# EAGLE design M-Controller (EAGLE 7.6.0)
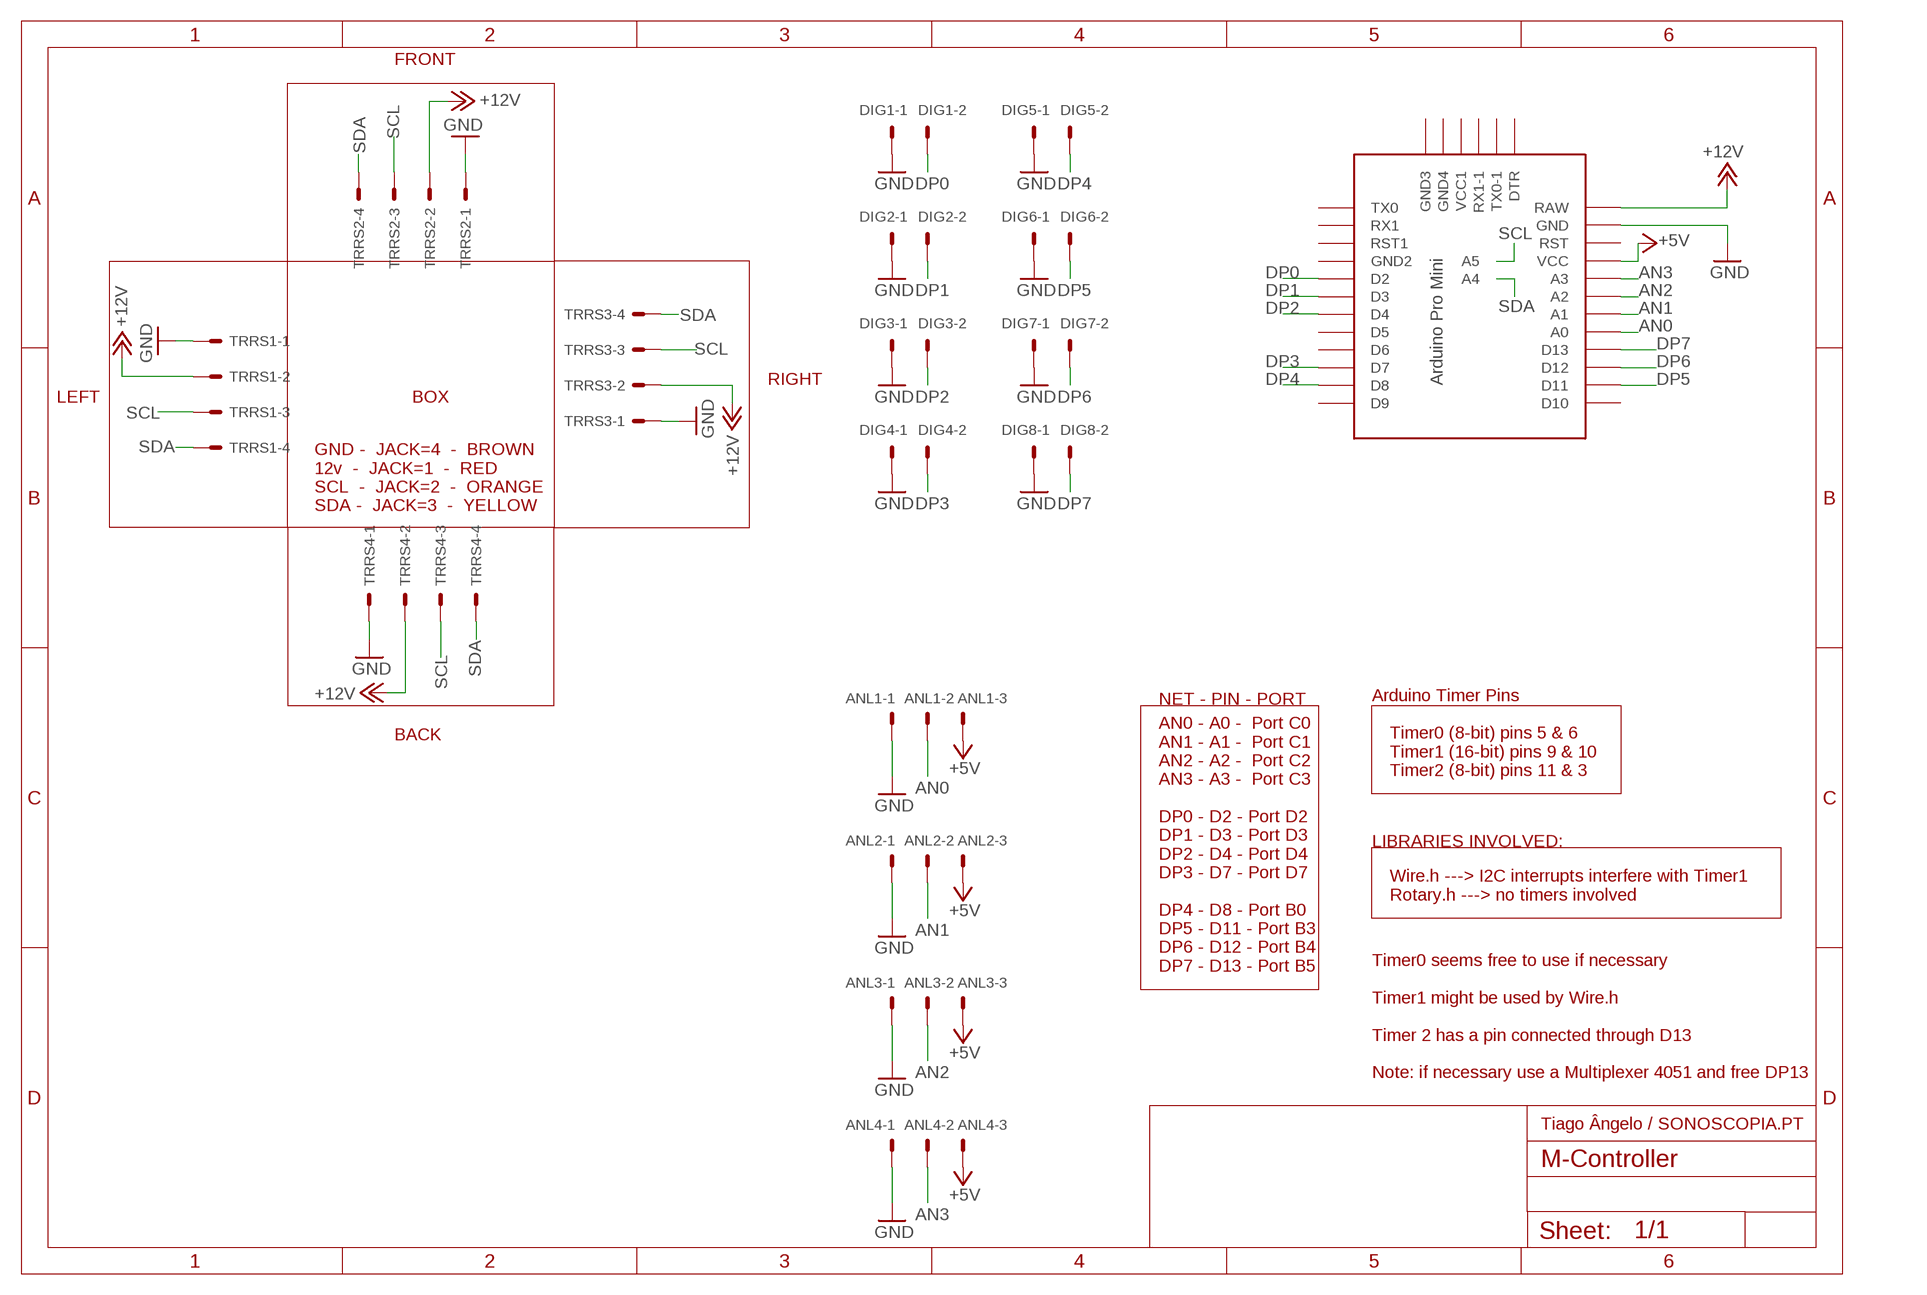
[diagram p0: schematic, sheet 1]

## Parts
ANL1  22-27-2031-03  [6410-03]
ANL2  22-27-2031-03  [6410-03]
ANL3  22-27-2031-03  [6410-03]
ANL4  22-27-2031-03  [6410-03]
DIG1  22-27-2021-02  [6410-02]
DIG2  22-27-2021-02  [6410-02]
DIG3  22-27-2021-02  [6410-02]
DIG4  22-27-2021-02  [6410-02]
DIG5  22-27-2021-02  [6410-02]
DIG6  22-27-2021-02  [6410-02]
DIG7  22-27-2021-02  [6410-02]
DIG8  22-27-2021-02  [6410-02]
TRRS1  22-27-2041-04  [6410-04]
TRRS2  22-27-2041-04  [6410-04]
TRRS3  22-27-2041-04  [6410-04]
TRRS4  22-27-2041-04  [6410-04]
U$1  PRO-MINI-2  [PRO-MINI-2]

## Nets
+5V: ANL1.3 ANL2.3 ANL3.3 ANL4.3 U$1.VCC
+12V: TRRS1.2 TRRS2.2 TRRS3.2 TRRS4.2 U$1.RAW
AN0: ANL1.2 U$1.A0
AN1: ANL2.2 U$1.A1
AN2: ANL3.2 U$1.A2
AN3: ANL4.2 U$1.A3
DP0: DIG1.2 U$1.D2
DP1: DIG2.2 U$1.D3
DP2: DIG3.2 U$1.D4
DP3: DIG4.2 U$1.D7
DP4: DIG5.2 U$1.D8
DP5: DIG6.2 U$1.D11
DP6: DIG7.2 U$1.D12
DP7: DIG8.2 U$1.D13
GND: ANL1.1 ANL2.1 ANL3.1 ANL4.1 DIG1.1 DIG2.1 DIG3.1 DIG4.1 DIG5.1 DIG6.1 DIG7.1 DIG8.1 TRRS1.1 TRRS2.1 TRRS3.1 TRRS4.1 U$1.GND
SCL: TRRS1.3 TRRS2.3 TRRS3.3 TRRS4.3 U$1.A5
SDA: TRRS1.4 TRRS2.4 TRRS3.4 TRRS4.4 U$1.A4
Unconnected: U$1.D5 U$1.D6 U$1.D9 U$1.D10 U$1.DTR U$1.GND1(GND2) U$1.GND2(GND3) U$1.GND3(GND4) U$1.RST U$1.RST1 U$1.RX1 U$1.RX1-1 U$1.TX0 U$1.TX0-1 U$1.VCC1

## Notes on the sheet
- FRONT
- RIGHT
- LEFT | BOX
- GND -  JACK=4  -  BROWN
  12v  -  JACK=1  -  RED
  SCL  -  JACK=2  -  ORANGE
  SDA -  JACK=3  -  YELLOW
- NET - PIN - PORT | Arduino Timer Pins
- BACK
- Timer0 (8-bit) pins 5 & 6
  Timer1 (16-bit) pins 9 & 10 
  Timer2 (8-bit) pins 11 & 3
- LIBRARIES INVOLVED:
- Wire.h ---> I2C interrupts interfere with Timer1
  Rotary.h ---> no timers involved
- AN0 - A0 -  Port C0
  AN1 - A1 -  Port C1
  AN2 - A2 -  Port C2
  AN3 - A3 -  Port C3 
  
  DP0 - D2 - Port D2
  DP1 - D3 - Port D3
  DP2 - D4 - Port D4
  DP3 - D7 - Port D7
  
  DP4 - D8 - Port B0
  DP5 - D11 - Port B3
  DP6 - D12 - Port B4
  DP7 - D13 - Port B5
- Timer0 seems free to use if necessary 
  
  Timer1 might be used by Wire.h
  
  Timer 2 has a pin connected through D13
  
  Note: if necessary use a Multiplexer 4051 and free DP13
- Tiago Ângelo / SONOSCOPIA.PT

## Library data of the parts
ANL1-ANL4 = _M-BLOCKS:22-?-03: CONNECTOR wire to board 2.54 mm (.1 inch) pitch header
DIG1-DIG8 = _M-BLOCKS:22-?-02: CONNECTOR wire to board 2.54 mm (.1 inch) pitch header
TRRS1-TRRS4 = _M-BLOCKS:22-?-04: CONNECTOR wire to board 2.54 mm (.1 inch) pitch header
U$1 = _M-BLOCKS:PRO-MINI-2: Arduino Pro Mini Layout 2 Sparkfun.com

## Board
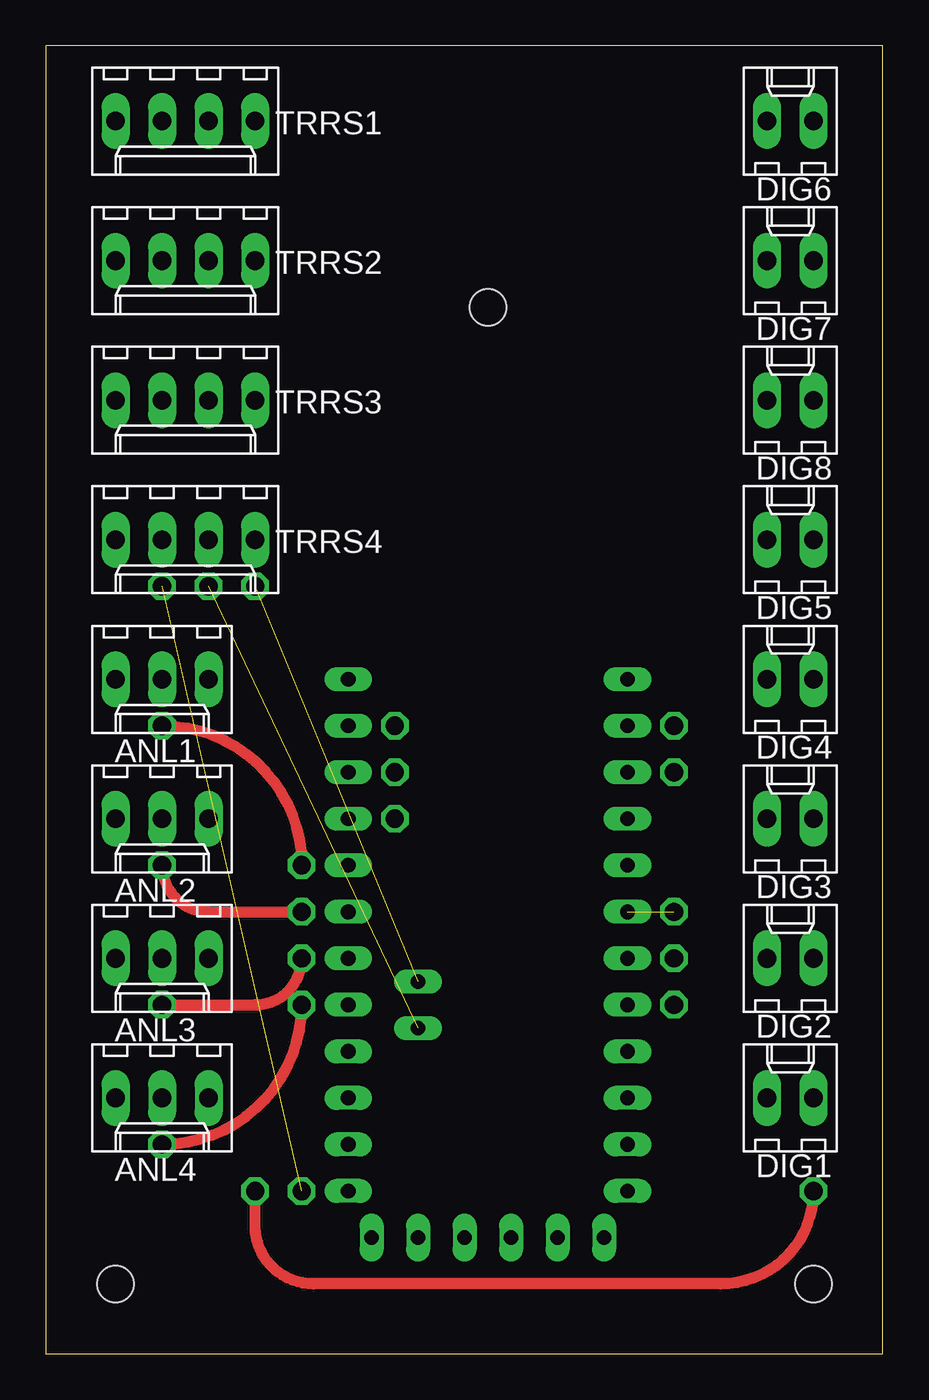
[diagram p1: board, top side]
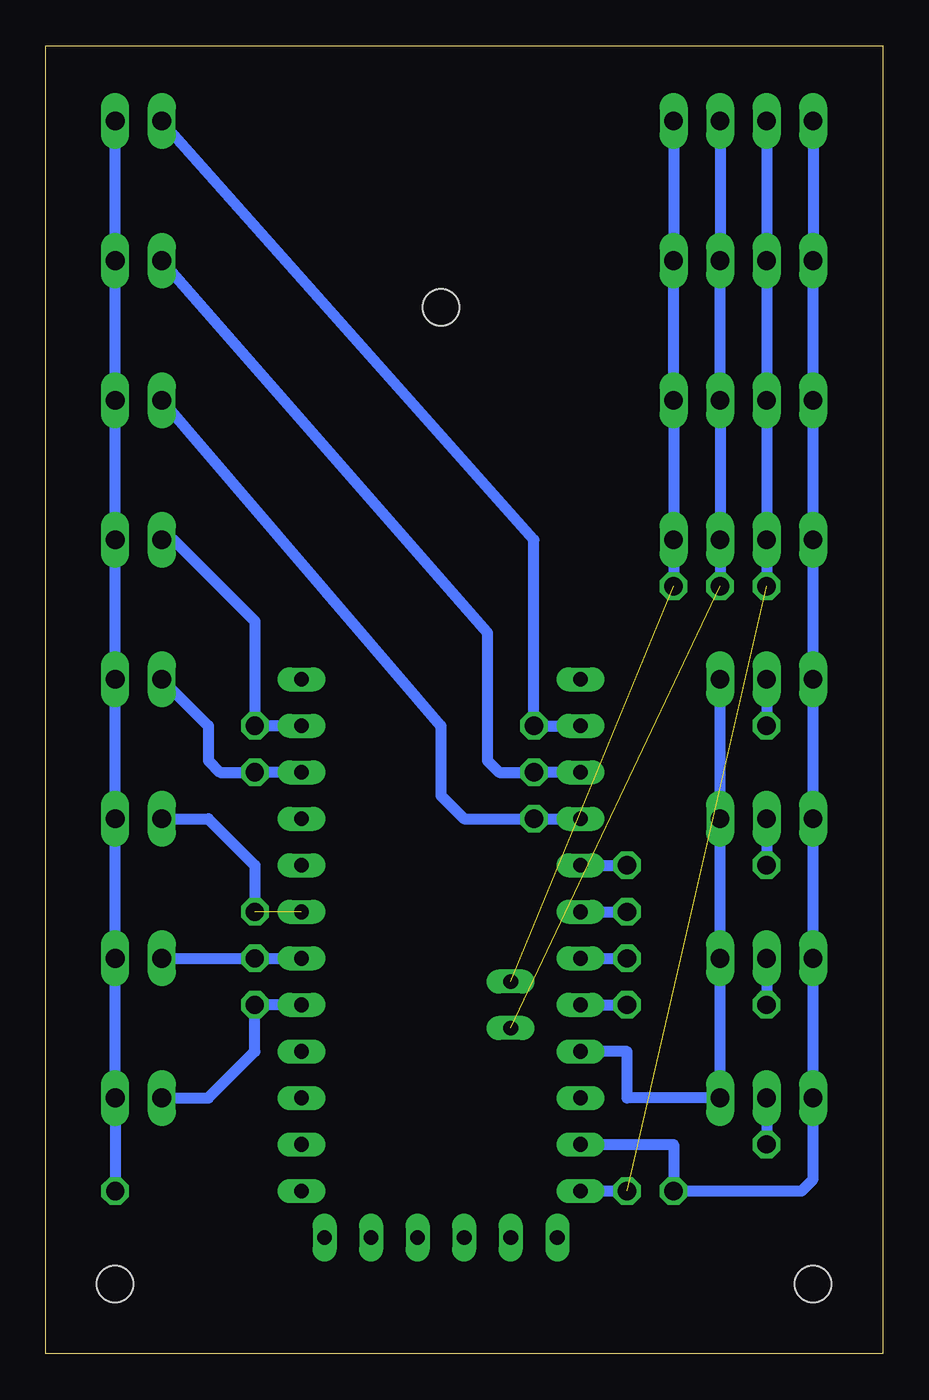
[diagram p2: board, bottom side, seen from below]

Size 45.7 x 71.42 mm. Coordinates in mm from the lower left corner, seen from the top.
Outline: 0,0 45.7,0 45.7,71.42 0,71.42 0,0
Copper layers (1*16): Top 0.035mm / dielectric 1.5mm / Bottom 0.035mm
Design rules "default": minimum track width 10mil, minimum drill 24mil, track to track 8mil, track to pad 8mil, pad to pad 8mil, via to via 8mil, smd to smd 8mil, copper to edge 40mil, drill to drill 8mil, minimum pad ring 10mil, minimum via ring 8mil, stop-mask expansion 4mil, vias tented up to drill 0mil, thermal gap 10mil
Holes 2 mm at 3.81,3.81 24.13,57.15 41.91,3.81

### Footprints (pad centres in the part's own frame; a part is rotated, then mirrored left to right if it is on the bottom)
6410-03 = drill 1.016 long: 1 2.54,0; 2 0,0; 3 -2.54,0
6410-02 = drill 1.016 long: 1 1.27,0; 2 -1.27,0
6410-04 = drill 1.016 long: 1 3.81,0; 2 1.27,0; 3 -1.27,0; 4 -3.81,0
PRO-MINI-2 = drill 0.8 long: A0 6.35,-5.08; A1 6.35,-2.54; A2 6.35,0; A3 6.35,2.54; A4 2.54,1.27; A5 2.54,3.81; D2 -8.89,2.54; D3 -8.89,0; D4 -8.89,-2.54; D5 -8.89,-5.08; D6 -8.89,-7.62; D7 -8.89,-10.16; D8 -8.89,-12.7; D9 -8.89,-15.24; D10 6.35,-15.24; D11 6.35,-12.7; D12 6.35,-10.16; D13 6.35,-7.62; DTR 5.08,15.24; GND 6.35,10.16; GND1 -8.89,5.08; GND2 -7.62,15.24; GND3 -5.08,15.24; RAW 6.35,12.7; RST 6.35,7.62; RST1 -8.89,7.62; RX1 -8.89,10.16; RX1-1 0,15.24; TX0 -8.89,12.7; TX0-1 2.54,15.24; VCC 6.35,5.08; VCC1 -2.54,15.24

### Placement (x,y rotation side)
ANL1  6.35,36.83 180 top
ANL2  6.35,29.21 180 top
ANL3  6.35,21.59 180 top
ANL4  6.35,13.97 180 top
DIG1  40.64,13.97 0 top
DIG2  40.64,21.59 0 top
DIG3  40.64,29.21 0 top
DIG4  40.64,36.83 0 top
DIG5  40.64,44.45 0 top
DIG6  40.64,67.31 0 top
DIG7  40.64,59.69 0 top
DIG8  40.64,52.07 0 top
TRRS1  7.62,67.31 180 top
TRRS2  7.62,59.69 180 top
TRRS3  7.62,52.07 180 top
TRRS4  7.62,44.45 180 top
U$1  22.86,21.59 180 top

### Tracks (layer width: path | path; a pad name or v marks a point on that pad's centre or on a via)
+5V
  Bottom 0.61: ANL1.3 ANL2.3 ANL3.3 ANL4.3 13.97,13.97 13.97,16.51 U$1.VCC
+12V  (via drill 1 pad 1.27)  (1 unrouted)
  Bottom 0.61: TRRS1.2 TRRS2.2 TRRS3.2 TRRS4.2 v6.35,41.91 | U$1.RAW v13.97,8.89
AN0  (via drill 1 pad 1.27)
  Top 0.61: v6.35,34.29 arc-90 v13.97,26.67
  Bottom 0.61: ANL1.2 v6.35,34.29 | U$1.A0 v13.97,26.67
AN1  (via drill 1 pad 1.27)
  Top 0.61: v6.35,26.67 arc90 8.89,24.13 v13.97,24.13
  Bottom 0.61: ANL2.2 v6.35,26.67 | U$1.A1 v13.97,24.13
AN2  (via drill 1 pad 1.27)
  Top 0.61: v6.35,19.05 11.43,19.05 arc90 v13.97,21.59
  Bottom 0.61: ANL3.2 v6.35,19.05 | U$1.A2 v13.97,21.59
AN3  (via drill 1 pad 1.27)
  Top 0.61: v6.35,11.43 arc90 v13.97,19.05
  Bottom 0.61: ANL4.2 v6.35,11.43 | U$1.A3 v13.97,19.05
DP0  (via drill 1 pad 1.27)
  Bottom 0.61: DIG1.2 36.83,13.97 34.29,16.51 v34.29,19.05 U$1.D2
DP1  (via drill 1 pad 1.27)
  Bottom 0.61: DIG2.2 v34.29,21.59 U$1.D3
DP2  (via drill 1 pad 1.27)  (1 unrouted)
  Bottom 0.61: DIG3.2 36.83,29.21 34.29,26.67 v34.29,24.13
DP3  (via drill 1 pad 1.27)
  Bottom 0.61: DIG4.2 36.83,34.29 36.83,32.38 36.2,31.75 v34.29,31.75 U$1.D7
DP4  (via drill 1 pad 1.27)
  Bottom 0.61: DIG5.2 38.73,44.45 34.29,40.01 v34.29,34.29 U$1.D8
DP5  (via drill 1 pad 1.27)
  Bottom 0.61: DIG6.2 19.05,44.45 v19.05,34.29 U$1.D11
DP6  (via drill 1 pad 1.27)
  Bottom 0.61: DIG7.2 21.59,39.37 21.59,32.38 20.95,31.75 v19.05,31.75 U$1.D12
DP7  (via drill 1 pad 1.27)
  Bottom 0.61: DIG8.2 24.13,34.29 24.13,30.48 22.86,29.21 v19.05,29.21 U$1.D13
GND  (via drill 1 pad 1.27)
  Top 0.61: v41.91,8.89 arc-90 36.83,3.81 14.61,3.81 arc-90 11.43,6.99 v11.43,8.89
  Bottom 0.61: DIG6.1 DIG7.1 DIG8.1 DIG5.1 DIG4.1 DIG3.1 DIG2.1 DIG1.1 v41.91,8.89 | TRRS1.1 TRRS2.1 TRRS3.1 TRRS4.1 ANL1.1 ANL2.1 ANL3.1 ANL4.1 3.81,9.53 4.45,8.89 v11.43,8.89 11.43,11.43 U$1.GND
SCL  (via drill 1 pad 1.27)  (1 unrouted)
  Bottom 0.61: TRRS1.3 TRRS2.3 TRRS3.3 TRRS4.3 v8.89,41.91
SDA  (via drill 1 pad 1.27)  (1 unrouted)
  Bottom 0.61: TRRS1.4 TRRS2.4 TRRS3.4 TRRS4.4 v11.43,41.91